# EAGLE schematic 9.3.2_transmitter (EAGLE 9.6.2)
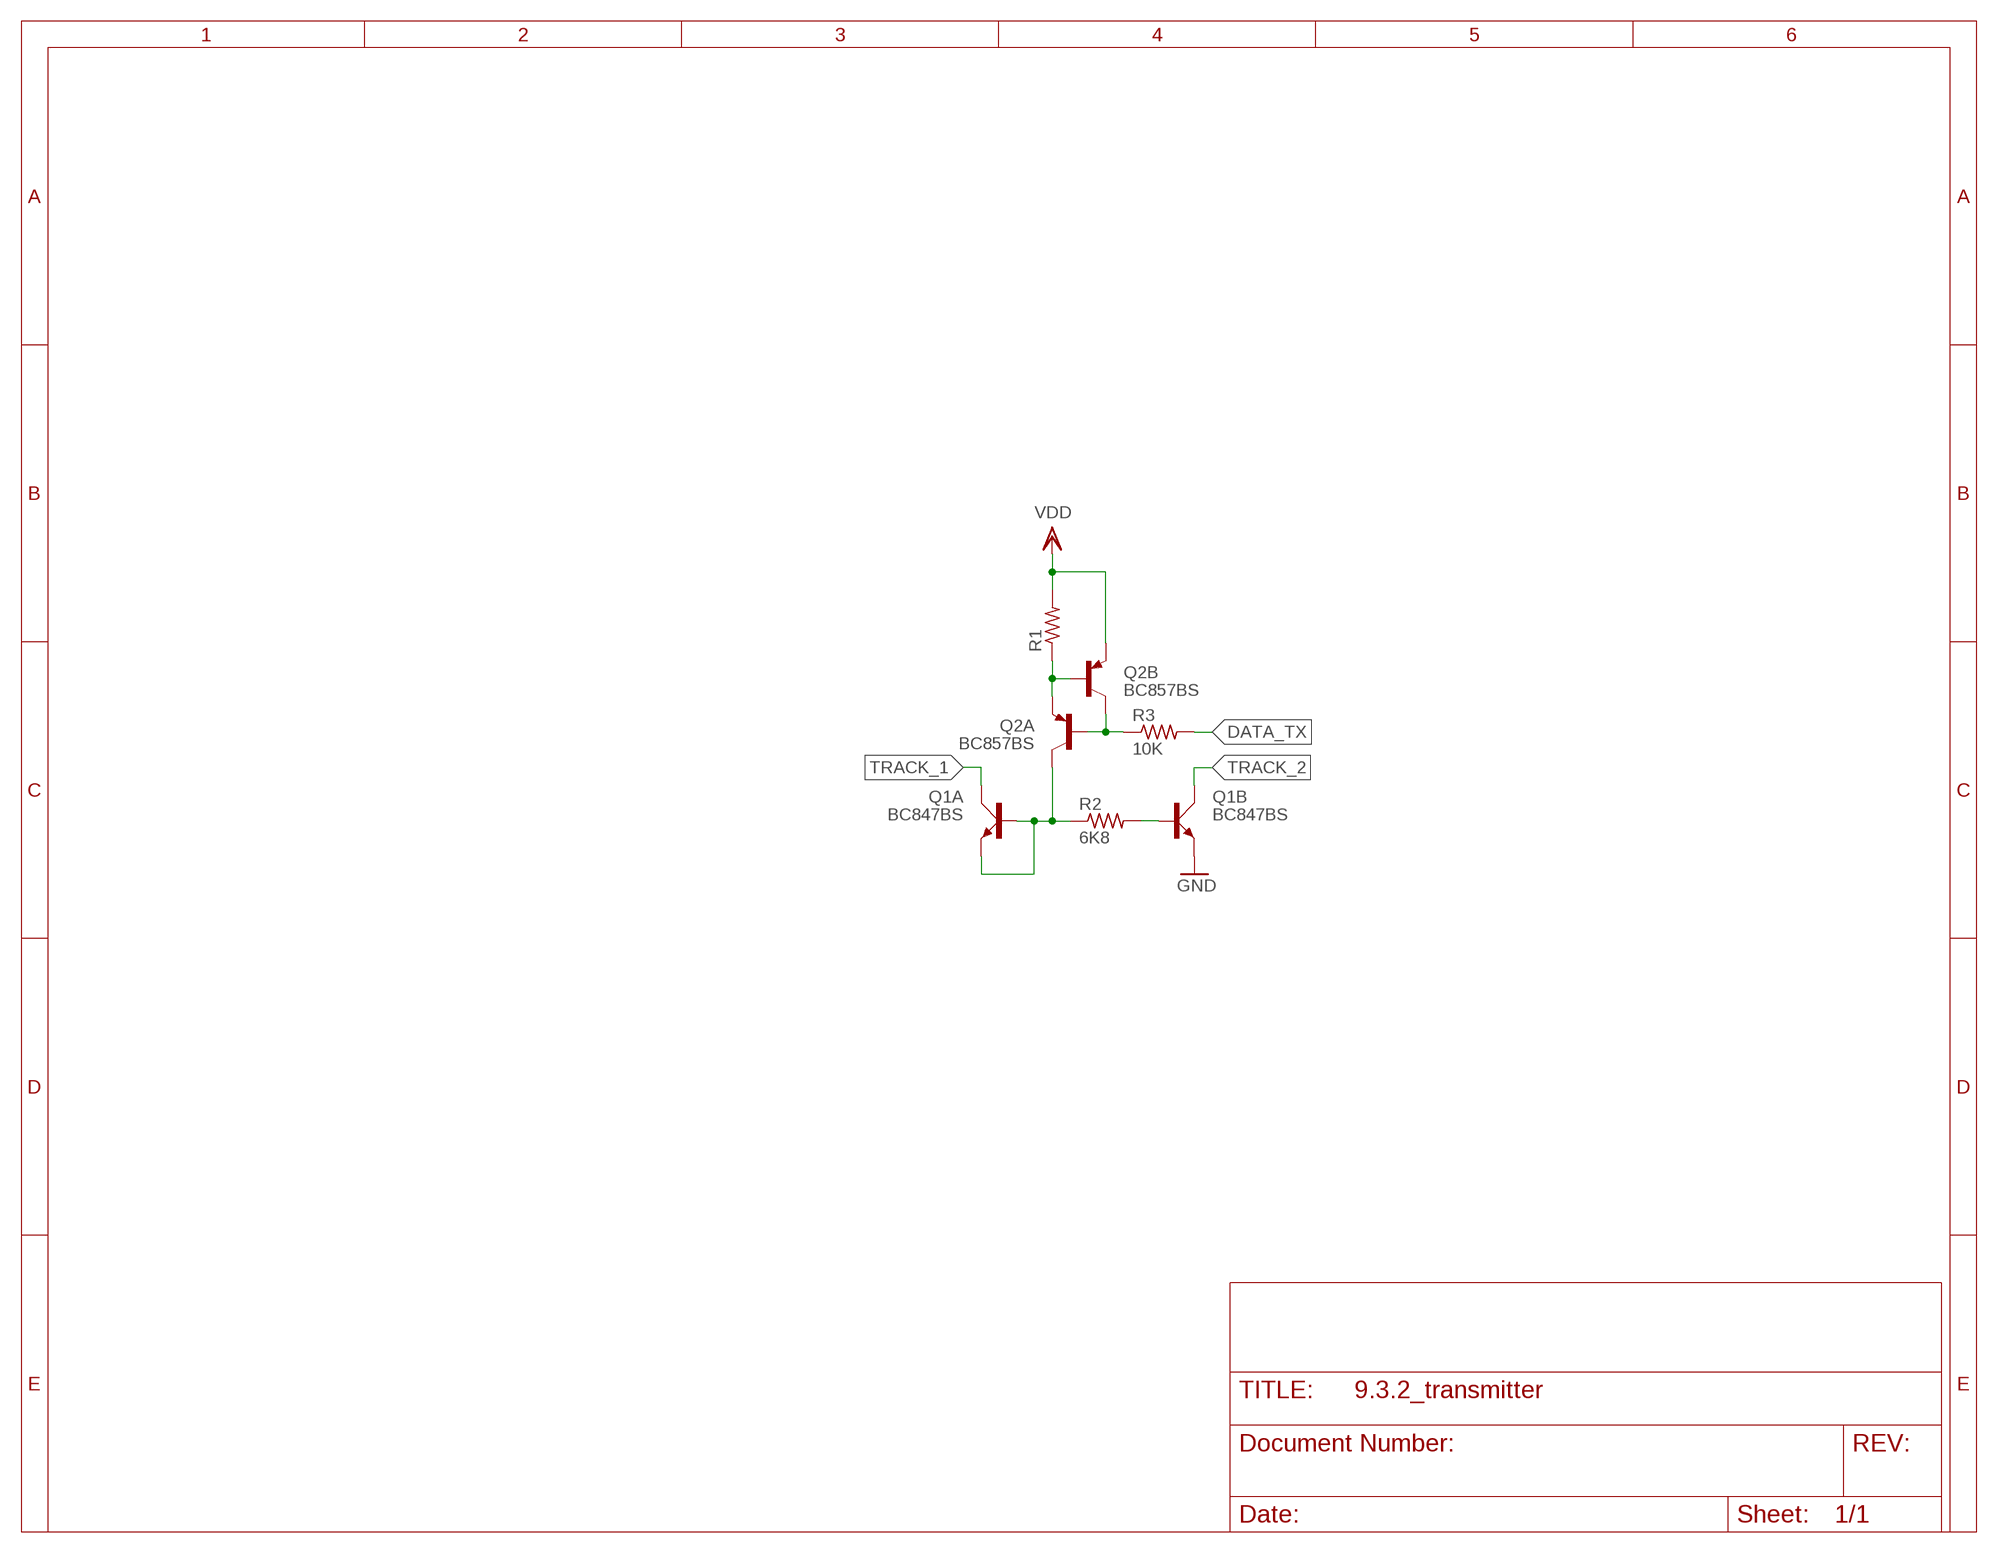
[diagram p0: schematic, sheet 1]

## Parts
Q1  BC847BS  [SOT363_PHILIPS]
Q2A  BC857BS  BC857BSMD  [SOT23-BEC]
Q2B  BC857BS  BC857BSMD  [SOT23-BEC]
R1  22R  R-US_R0402  [R0402]
R2  6K8  R-US_R0402  [R0402]
R3  10K  R-US_R0402  [R0402]

## Nets
DATA_TX: R3.2
GND: Q1.4(B:E)
N$1: Q2A.E Q2B.B R1.1
N$2: Q2A.B Q2B.C R3.1
N$3: Q1.5(B:B) R2.2
N$4: Q1.1(A:E) Q1.2(A:B) Q2A.C R2.1
TRACK_1: Q1.6(A:C)
TRACK_2: Q1.3(B:C)
VDD: Q2B.E R1.2

## Library data of the parts
Q1 = transistor-small-signal:BC847BS: NPN general purpose double transistor Source: http://www.farnell.com/datasheets/2466.pdf
Q2A Q2B = transistor-pnp:BC857*: PNP Transistror
R1-R3 = resistor:R-US_: RESISTOR, American symbol